# EasyEDA Pro project PY32单片机版电池內阻测试仪.eprj, board PY32版电池內阻测试仪
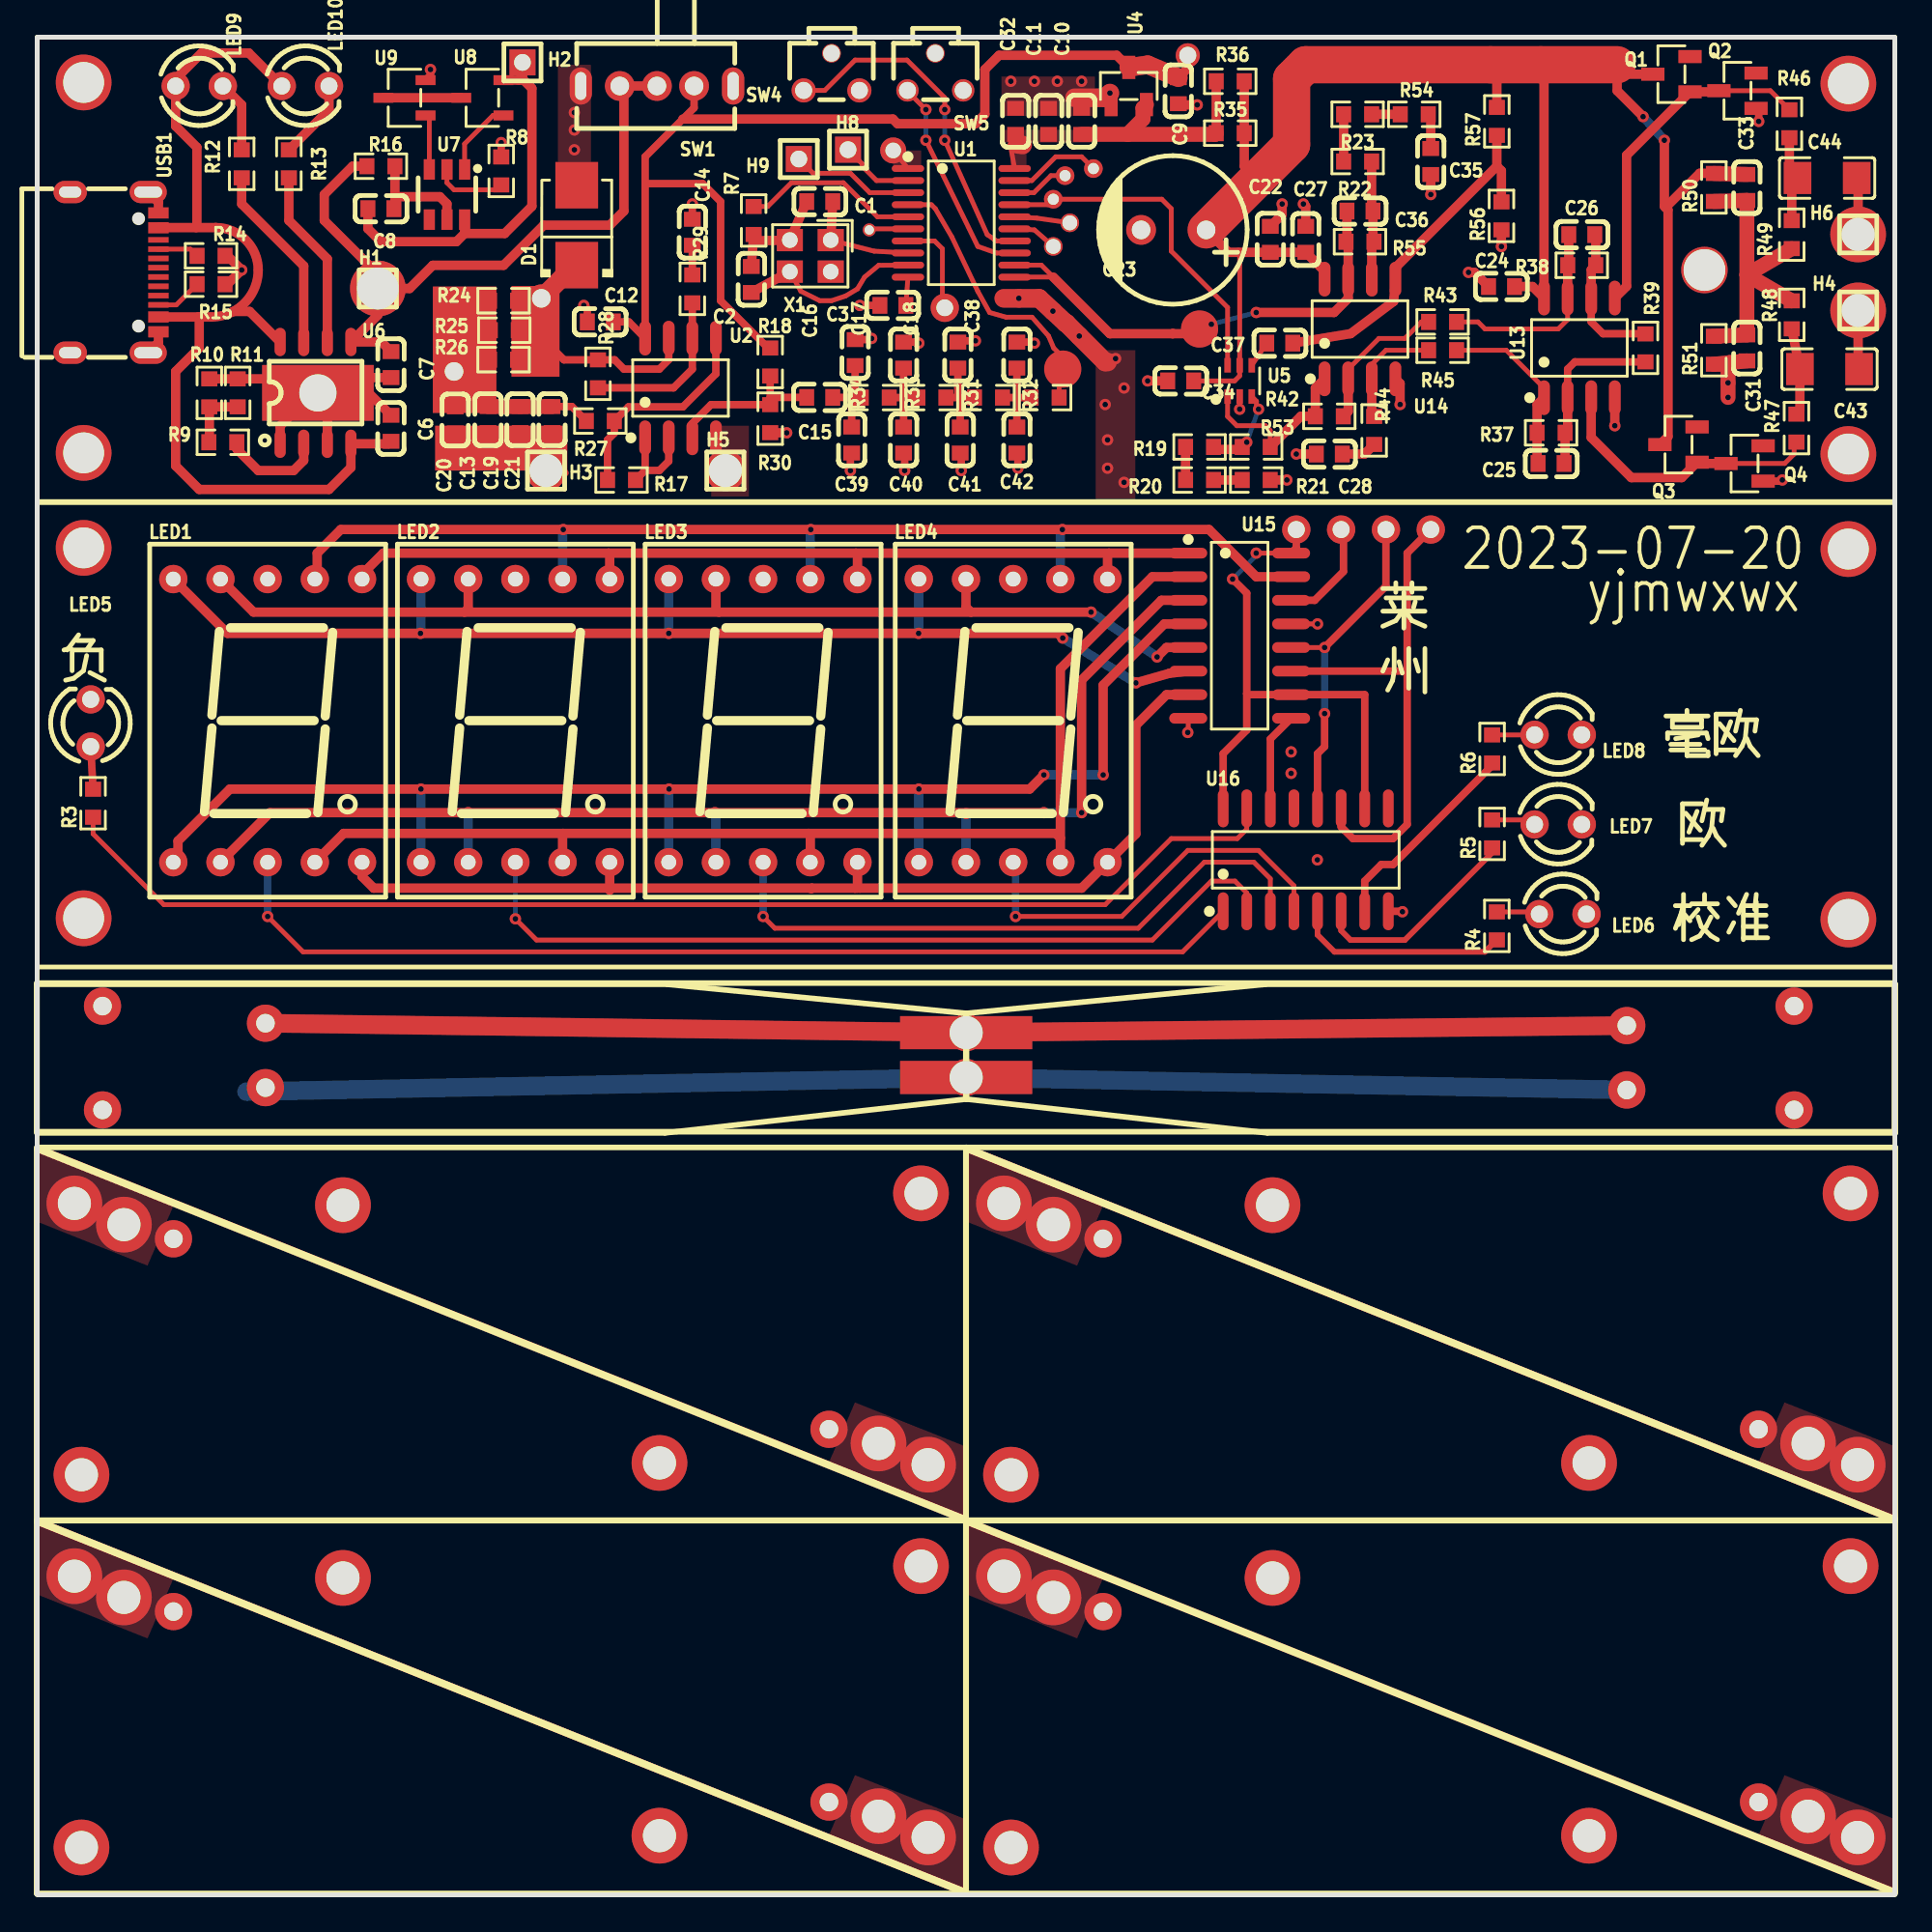
[diagram p1: board, top side]
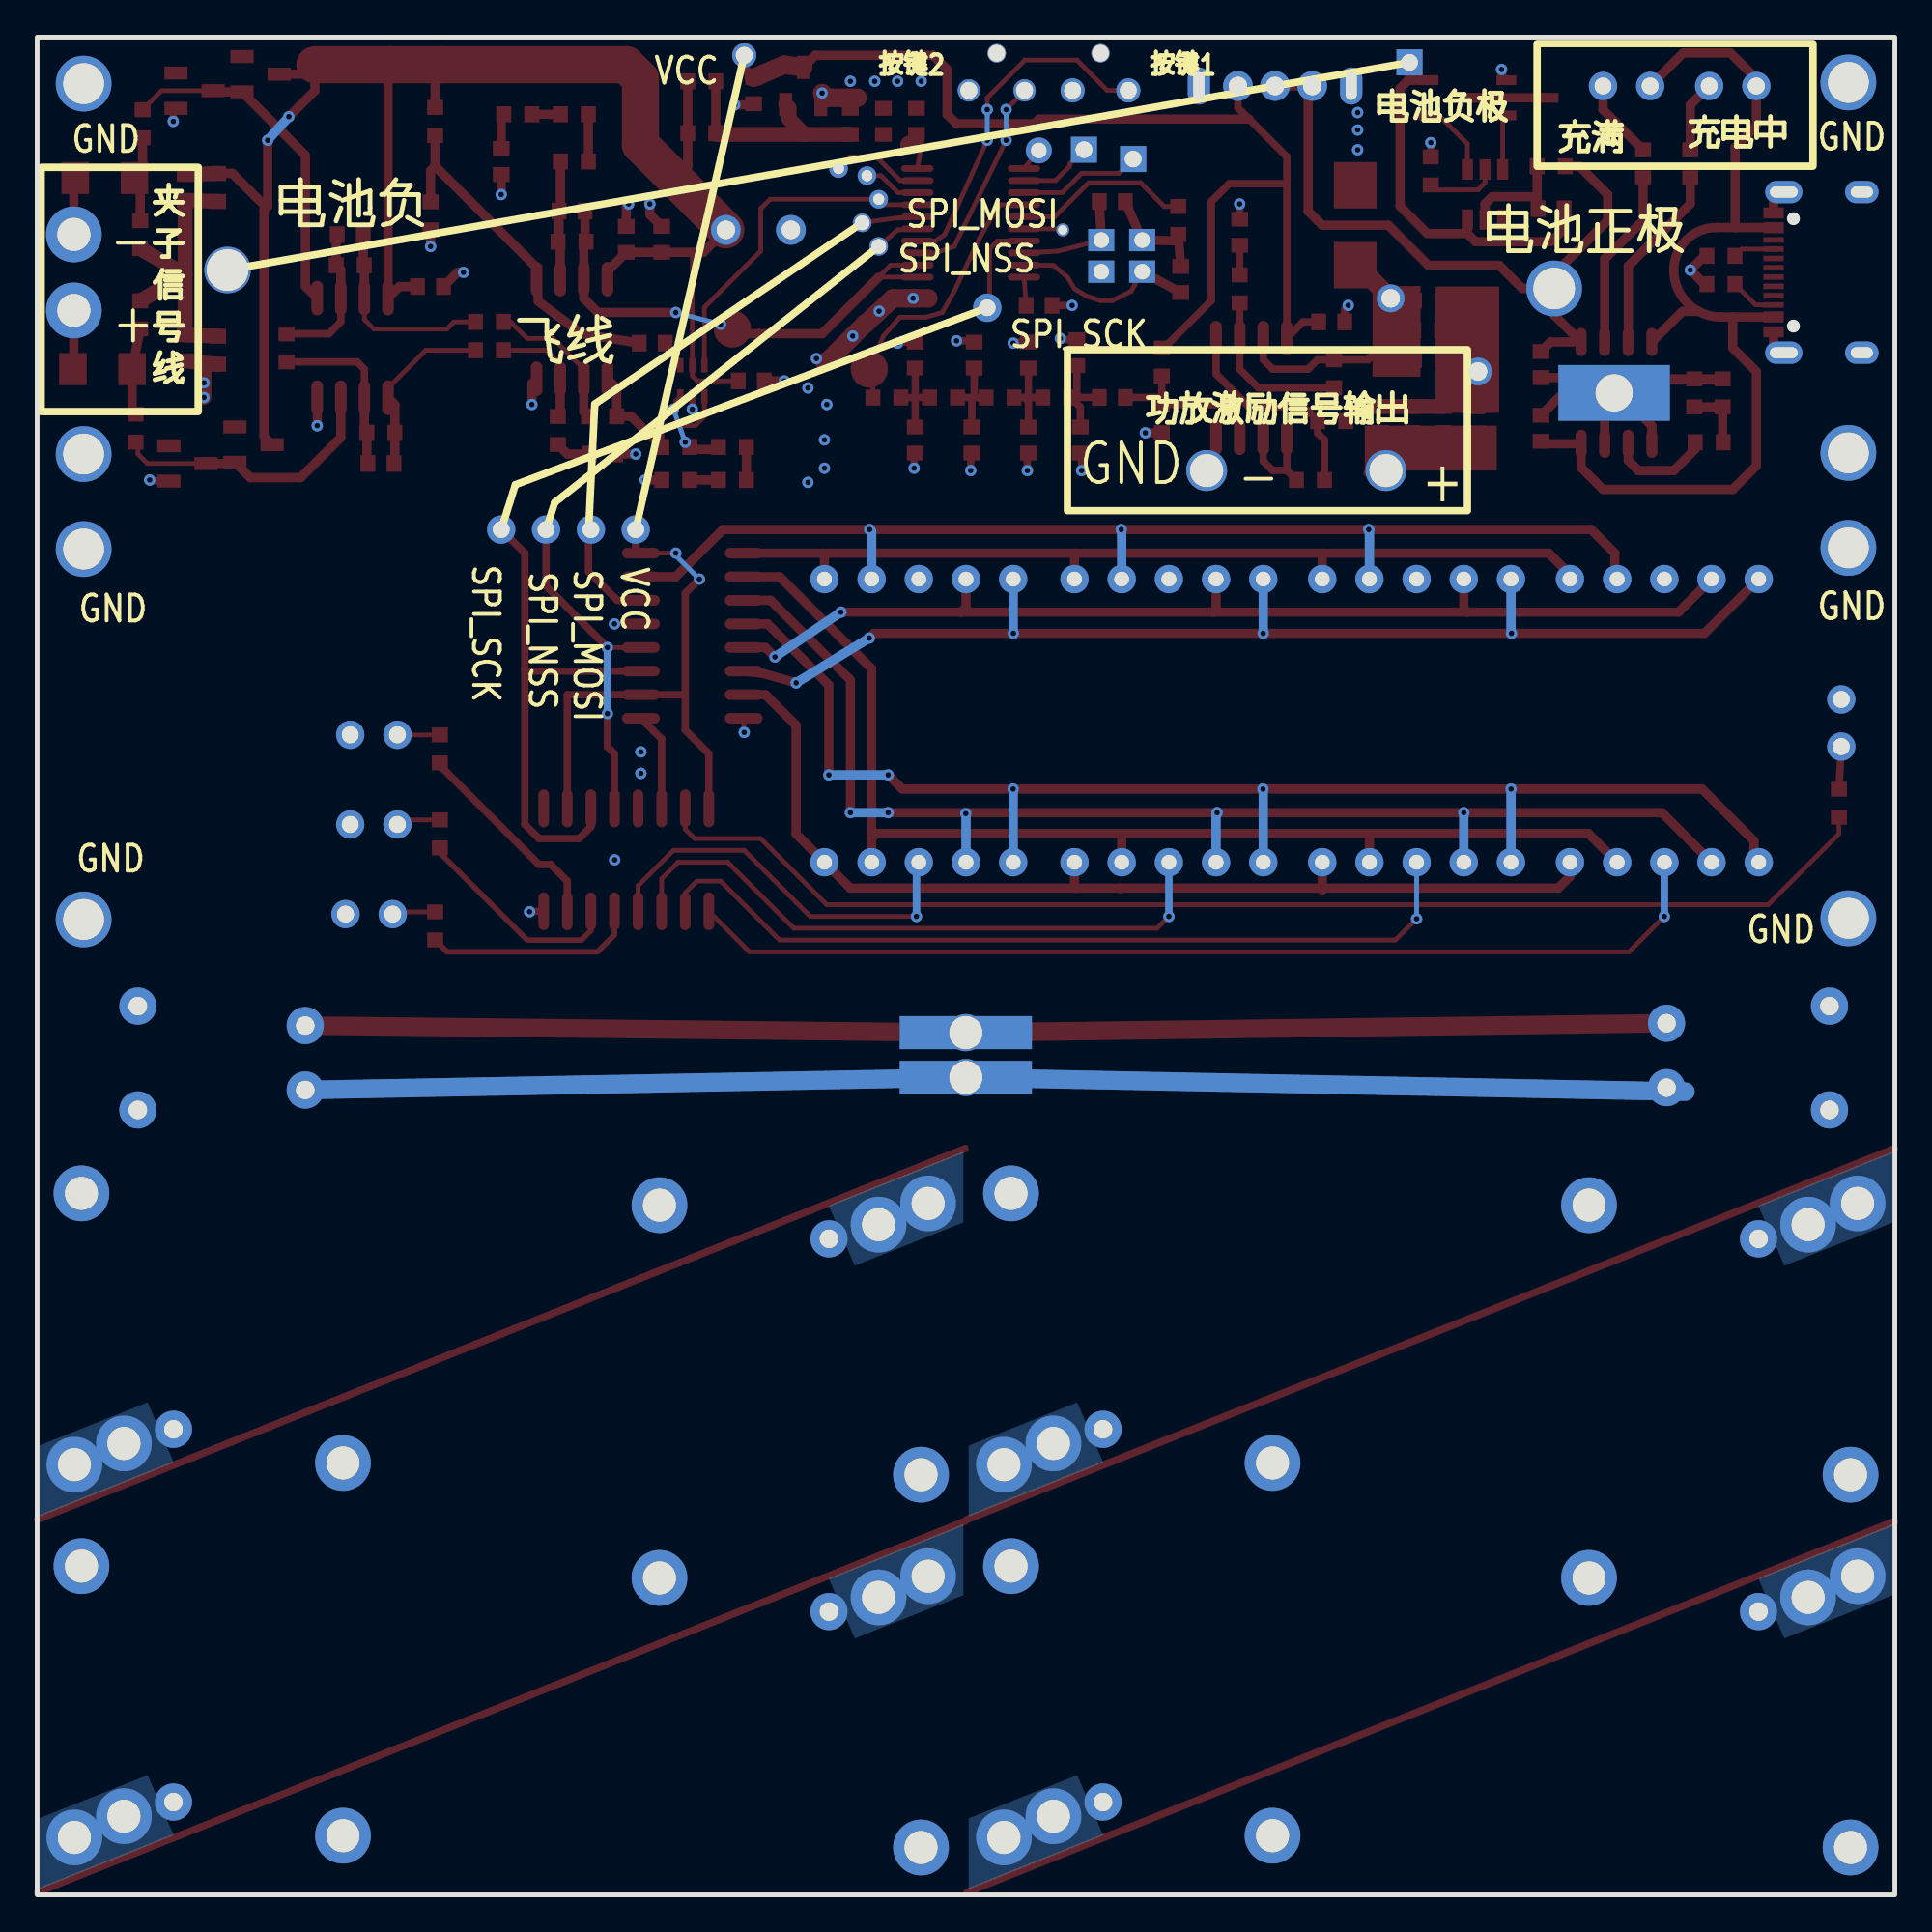
[diagram p2: board, bottom side, seen from below]

Outline 100 x 100 mm; copper layers: Top Layer, Bottom Layer. Coordinates in mm from the lower left corner of the outline.
Outline path: rectangle 0,100 100,0
Stack: Top Layer 0.035mm / Dielectric1 1.51mm FR4 er 4.5 / Bottom Layer 0.035mm

## Design rules (mm)
template: 用户自定义配置
spacing safeClearance (default): track to track 0.152, other pairs 0.152 to 0.3
track width trackWidth (default): min 0.127, default 0.254, max 2.54
differential pair differentialPair (default): width min 0.127, default 0.254, max 2.54; gap min 0.152, default 0.152
via viaSize (default): diameter min 0.5, default 0.61, max 10; hole min 0.3, default 0.305, max 6

## Placement (name value [footprint] x y rotation side)
C1  10pF  [C0603]  42.13 91.15 180 top
C2  10pF  [C0603]  38.44 86.96 270 top
C3  100nF  [C0603]  46.06 85.56 0 top
C6  10uF  [C0603]  19.05 78.95 90 top
C7  10uF  [C0603]  19.05 82.38 90 top
C8  100nF  [C0603]  18.5 90.77 180 top
C9  10uF  [C0603]  61.43 97.12 90 top
C10  100nF  [C0603]  56.22 95.47 270 top
C11  10uF  [C0603]  54.44 95.47 270 top
C12  100nF  [C0603]  30.31 84.67 0 top
C13  10uF  [C0603]  24.27 79.42 90 top
C14  10uF  [C0603]  35.27 89.5 270 top
C15  10uF  [C0603]  42.13 80.61 0 top
C16  1nF  [C0603]  44.03 83.02 270 top
C17  1nF  [C0603]  46.64 82.89 270 top
C18  1nF  [C0603]  49.56 82.89 270 top
C19  10uF  [C0603]  26 79.42 90 top
C20  10uF  [C0603]  22.51 79.4 90 top
C21  10uF  [C0603]  27.72 79.42 90 top
C22  100nF  [C0603]  66.38 89.12 270 top
C23  470uF  [CAP-TH_BD8.0-P3.50-D0.6-FD]  61.18 89.62 180 top
C24  10uF  [C0603]  78.83 86.58 0 top
C25  1nF  [C0603]  81.5 77.05 180 top
C26  1nF  [C0603]  83.15 89.37 180 top
C27  10uF  [C0603]  68.29 89.12 90 top
C28  10uF  [C0603]  69.56 77.56 180 top
C31  10uF  [C0603]  92.04 83.27 90 top
C32  10uF  [C0603]  52.67 95.47 270 top
C33  10uF  [C0603]  92.04 91.91 90 top
C34  10uF  [C0603]  61.56 81.5 180 top
C35  10uF  [C0603]  75.02 93.31 90 top
C36  1nF  [C0603]  71.21 90.64 180 top
C37  100nF  [C0603]  66.89 83.53 180 top
C38  1nF  [C0603]  52.74 82.89 270 top
C39  1nF  [C0603]  43.85 78.31 270 top
C40  1nF  [C0603]  46.64 78.31 270 top
C41  1nF  [C0603]  49.69 78.31 270 top
C42  1nF  [C0603]  52.74 78.31 270 top
C43  100nF  [C1206]  96.48 82.13 180 top
C44  100nF  [C1206]  96.35 92.42 180 top
D1  SMBJ5.0A  [SMB_L4.3-W3.6-LS5.3-RD]  29.04 89.88 90 top
H1  -  [hdr-th_1p-v-m_xkb_x4611wv-01i-c28d40#2]  18.34 86.47 0 top
H2  -  [HDR-TH_1P-V-M_XKB_X4611WV-01I-C28D40]  26.12 98.64 0 top
H3  -  [hdr-th_1p-v-m_xkb_x4611wv-01i-c28d40#3]  27.39 76.67 0 top
H4  -  [hdr-th_1p-v-m_xkb_x4611wv-01i-c28d40]  98.02 85.29 0 top
H5  -  [hdr-th_1p-v-m_xkb_x4611wv-01i-c28d40#3]  37.05 76.67 0 top
H6  -  [hdr-th_1p-v-m_xkb_x4611wv-01i-c28d40]  98.02 89.38 0 top
H8  -  [HDR-TH_1P-V-M_XKB_X4611WV-01I-C28D40]  43.65 93.94 180 top
H9  -  [HDR-TH_1P-V-M_XKB_X4611WV-01I-C28D40]  41 93.44 0 top
LED1  SM420561N  [LED-SEG-TH_10P-L12.7-W19.0-P2.54-S15.24-BL]  12.41 63.21 0 top
LED2  SM420561N  [LED-SEG-TH_10P-L12.7-W19.0-P2.54-S15.24-BL]  25.74 63.21 0 top
LED3  SM420561N  [LED-SEG-TH_10P-L12.7-W19.0-P2.54-S15.24-BL]  39.08 63.21 0 top
LED4  SM420561N  [LED-SEG-TH_10P-L12.7-W19.0-P2.54-S15.24-BL]  52.54 63.21 0 top
LED5  -  [LED_TH-3mm]  2.88 63.08 90 top
LED6  -  [LED_TH-3mm]  82.13 52.79 0 top
LED7  -  [LED_TH-3mm]  81.88 57.62 0 top
LED8  -  [LED_TH-3mm]  81.88 62.45 0 top
LED9  -  [LED_TH-3mm]  8.72 97.37 0 top
LED10  -  [LED_TH-3mm]  14.44 97.37 0 top
NOREF  -  [Pad_e1473]  3.52 47.84 0 top
NOREF#2  -  [Pad_e1215]  4.67 16.01 0 top
NOREF#3  -  [Pad_e1288]  54.71 16.01 0 top
NOREF#4  -  [Pad_e1341]  52.04 37.22 0 top
NOREF#5  -  [Pad_e537]  54.7 91.28 0 top
NOREF#6  -  [Pad_e1147]  47.96 3.09 0 top
NOREF#7  -  [Pad_e34]  44.79 89.62 0 top
NOREF#8  -  [Pad_e1367]  67.78 73.5 0 top
NOREF#9  -  [Pad_e1248]  98 3.09 0 top
NOREF#10  -  [Pad_e1457]  12.29 43.45 0 top
NOREF#11  -  [Pad_e1366]  92.66 25.06 0 top
NOREF#12  -  [Pad_e1474]  3.52 42.25 0 top
NOREF#13  -  [Pad_e242]  15.11 80.85 90 top
NOREF#14  -  [Pad_e98]  97.5 72.44 0 top
NOREF#15  -  [Pad_e1460]  85.57 43.33 0 top
NOREF#16  -  [Pad_e596]  26.83 84.16 0 top
NOREF#17  -  [Pad_e1303]  33.5 23.25 0 top
NOREF#18  -  [Pad_e592]  55.21 82.13 0 top
NOREF#19  -  [Pad_e1451]  50.01 46.41 0 top
NOREF#20  -  [Pad_e1290]  57.38 15.25 0 top
NOREF#21  -  [Pad_e1335]  47.58 37.76 0 top
NOREF#22  -  [Pad_e1337]  52.42 22.62 0 top
NOREF#23  -  [Pad_e536]  54.7 88.73 0 top
NOREF#24  -  [Pad_e508]  22.44 82 0 top
NOREF#25  -  [Pad_e1342]  54.71 36.08 0 top
NOREF#26  -  [Pad_e1475]  94.58 47.84 0 top
NOREF#27  -  [Pad_e15]  2.5 77.62 0 top
NOREF#28  -  [Pad_e1185]  2.38 2.55 0 top
NOREF#29  -  [Pad_e1238]  47.58 17.69 0 top
NOREF#30  -  [Pad_e1350]  97.62 37.76 0 top
NOREF#31  -  [Pad_e571]  27.14 85.94 0 top
NOREF#32  -  [Pad_e1454]  50.01 46.41 0 top
NOREF#33  -  [Pad_e1453]  50.01 44 0 top
NOREF#34  -  [Pad_e1278]  92.66 5 0 top
NOREF#35  -  [Pad_e597]  23.01 83.17 0 top
NOREF#36  -  [Pad_e1368]  83.54 23.25 0 top
NOREF#37  -  [Pad_e1306]  2 37.22 0 top
NOREF#38  -  [Pad_e1179]  16.46 17.06 0 top
NOREF#39  -  [Pad_e1165]  45.29 4.23 0 top
NOREF#40  -  [Pad_e1330]  45.29 24.3 0 top
NOREF#41  -  [Pad_e599]  24.98 77.88 0 top
NOREF#42  -  [Pad_e542]  56.86 92.93 0 top
NOREF#43  -  [Pad_e1363]  70.19 73.5 0 top
NOREF#44  -  [Pad_e1353]  98 23.16 0 top
NOREF#45  -  [Pad_e31]  48.86 85.43 0 top
NOREF#46  -  [Pad_e1336]  66.5 37.13 0 top
NOREF#47  -  [Pad_e1203]  2 17.15 0 top
NOREF#48  -  [Pad_e1343]  57.38 35.31 0 top
NOREF#49  -  [Pad_e1267]  95.33 4.23 0 top
NOREF#50  -  [Pad_e1242]  42.62 5 0 top
NOREF#51  -  [Pad_e1361]  95.33 24.3 0 top
NOREF#52  -  [Pad_e1257]  97.5 77.56 0 top
NOREF#53  -  [Pad_e1455]  50.01 46.41 0 top
NOREF#54  -  [Pad_e1364]  72.61 73.5 0 top
NOREF#55  -  [Pad_e1256]  97.5 97.5 0 top
NOREF#56  -  [Pad_e1459]  85.57 46.79 0 top
NOREF#57  -  [Pad_e1476]  94.58 42.25 0 top
NOREF#58  -  [Pad_e1307]  4.67 36.08 0 top
NOREF#59  -  [Pad_e1458]  12.29 46.92 0 top
NOREF#60  -  [Pad_e1294]  52.42 2.55 0 top
NOREF#61  -  [Pad_e1456]  50.01 44 0 top
NOREF#62  -  [Pad_e538]  55.33 92.55 0 top
NOREF#63  -  [Pad_e1293]  66.5 17.06 0 top
NOREF#64  -  [Pad_e1286]  52.04 17.15 0 top
NOREF#65  -  [Pad_e535]  55.59 90 0 top
NOREF#66  -  [Pad_e1452]  50.01 44 0 top
NOREF#67  -  [Pad_e100]  97.5 52.5 0 top
NOREF#68  -  [Pad_e92]  2.5 52.57 0 top
NOREF#69  -  [Pad_e1246]  97.62 17.69 0 top
NOREF#70  -  [Pad_e1312]  2.38 22.62 0 top
NOREF#71  -  [Pad_e1365]  75.02 73.5 0 top
NOREF#72  -  [Pad_e1324]  47.96 23.16 0 top
NOREF#73  -  [Pad_e1308]  7.34 35.31 0 top
NOREF#74  -  [Pad_e349]  46.08 93.9 180 top
NOREF#75  -  [Pad_e1222]  7.34 15.25 0 top
NOREF#76  -  [Pad_e1157]  62.57 84.29 0 top
NOREF#77  -  [Pad_e609]  89.75 87.47 0 top
NOREF#78  -  [Pad_e1311]  16.46 37.13 0 top
NOREF#79  -  [Pad_e1186]  33.5 3.18 0 top
NOREF#80  -  [Pad_e1279]  83.54 3.18 0 top
NOREF#81  -  [Pad_e1302]  42.62 25.06 0 top
NOREF#82  -  [Pad_e14]  2.5 97.56 0 top
NOREF#83  -  [Pad_e2036]  61.94 99.02 0 top
NOREF#84  -  [Pad_e94]  2.5 72.51 0 top
Q1  SS8050  [SOT-23-3_L2.9-W1.3-P1.90-LS2.4-BR]  87.97 98.01 0 top
Q2  SS8050  [SOT-23-3_L2.9-W1.3-P1.90-LS2.4-BR]  91.53 97.12 0 top
Q3  SS8050  [SOT-23-3_L2.9-W1.3-P1.90-LS2.4-BR]  88.35 78.07 0 top
Q4  SS8050  [SOT-23-3_L2.9-W1.3-P1.90-LS2.4-BR]  91.91 77.05 0 top
R3  1K  [R0603]  3.01 58.76 90 top
R4  1K  [R0603]  78.57 52.16 90 top
R5  1K  [R0603]  78.32 57.11 90 top
R6  1K  [R0603]  78.32 61.68 90 top
R7  10K  [R0603]  38.57 90.13 90 top
R8  1K  [R0603]  24.98 92.8 270 top
R9  1K  [R0603]  10 78.19 0 top
R10  1K  [R0603]  9.27 80.85 270 top
R11  1K  [R0603]  10.79 80.85 270 top
R12  1K  [R0603]  11.01 93.18 90 top
R13  1K  [R0603]  13.55 93.18 90 top
R14  10K  [R0603]  9.36 88.23 180 top
R15  10K  [R0603]  9.36 86.7 180 top
R16  100  [R0603]  18.5 93.05 180 top
R17  10K  [R0603]  31.46 76.16 0 top
R18  1M  [R0603]  39.46 82.51 90 top
R19  100  [R0603]  62.57 77.94 0 top
R20  100  [R0603]  62.57 76.16 180 top
R21  100  [R0603]  65.62 76.16 180 top
R22  100  [R0603]  71.08 93.31 0 top
R23  100  [R0603]  71.08 95.85 180 top
R24  100  [R0603]  25.11 85.81 0 top
R25  100  [R0603]  25.15 84.23 0 top
R26  100  [R0603]  25.11 82.64 0 top
R27  100K  [R0603]  30.31 79.34 0 top
R28  100K  [R0603]  30.19 81.88 270 top
R29  10K  [R0603]  35.27 86.45 270 top
R30  1M  [R0603]  39.46 79.46 90 top
R31  100K  [R0603]  51.21 80.6 180 top
R32  100K  [R0603]  54.26 80.6 180 top
R33  100K  [R0603]  48.16 80.6 180 top
R34  100K  [R0603]  45.12 80.6 180 top
R35  10Ω  [R0603]  64.22 94.83 180 top
R36  10Ω  [R0603]  64.22 97.62 180 top
R37  10K  [R0603]  81.5 78.7 180 top
R38  10K  [R0603]  83.15 87.72 180 top
R39  1K  [R0603]  86.58 83.27 270 top
R42  10K  [R0603]  69.56 79.59 180 top
R43  10K  [R0603]  75.65 84.67 180 top
R44  10K  [R0603]  71.97 78.83 270 top
R45  10K  [R0603]  75.65 83.15 180 top
R46  1K  [R0603]  94.32 95.34 90 top
R47  1K  [R0603]  94.7 78.96 270 top
R48  1M  [R0603]  94.45 85.05 270 top
R49  1M  [R0603]  94.45 89.37 270 top
R50  1K  [R0603]  90.26 91.91 90 top
R51  1K  [R0603]  90.26 83.15 90 top
R53  10K  [R0603]  65.62 77.94 0 top
R54  100  [R0603]  74.13 95.85 180 top
R55  10K  [R0603]  71.21 88.99 180 top
R56  1M  [R0603]  78.82 90.38 90 top
R57  1M  [R0603]  78.57 95.47 90 top
SW1  SK-12D02-G060  [SW-TH_SK-12D02-G060]  33.36 97.37 180 top
SW4  HX TS4538B3J 250gf  [sw-th_ts4538b3j#2]  42.76 98.13 180 top
SW5  HX TS4538B3J 250gf  [sw-th_ts4538b3j]  48.35 98.13 180 top
U1  PY32F002AF15P6TU  [TSSOP-20_L6.5-W4.4-P0.65-LS6.4-BL]  49.75 90 270 top
U2  LMV358ARZ  [SOP-8_L4.9-W3.9-P1.27-LS6.0-BL]  34.63 81.11 0 top
U4  662K.  [SOT-23-3_L2.9-W1.3-P1.90-LS2.4-BR]  58.76 97.37 270 top
U5  SGM3157  [SC-70-6_L2.2-W1.3-P0.65-LS2.1-BL]  64.73 81.5 0 top
U6  WSP4056  [SOP-8_L5.1-W3.9-P1.27-LS6.0-BL]  14.98 80.85 0 top
U7  WSTDW01  [SOT-23-6_L2.9-W1.6-P0.95-LS2.8-BR]  22.06 91.53 90 top
U8  AO3400A  [SOT-23-3_L3.0-W1.6-P1.90-LS2.8-BR]  23.97 96.74 0 top
U9  AO3400A  [SOT-23-3_L3.0-W1.6-P1.90-LS2.8-BR]  19.77 96.74 0 top
U13  LMV358ARZ  [SOP-8_L4.9-W3.9-P1.27-LS6.0-BL]  83.02 83.27 0 top
U14  LMV358ARZ  [SOP-8_L4.9-W3.9-P1.27-LS6.0-BL]  71.21 84.29 0 top
U15  74HC595D.  [SOP-16_L9.9-W3.9-P1.27-LS6.0-BL]  64.73 67.78 270 top
U16  74HC595D.  [SOP-16_L9.9-W3.9-P1.27-LS6.0-BL]  68.29 55.72 0 top
USB1  TYPE-C 16PIN 2MD(073)  [USB-C-SMD_TYPE-C-6PIN-2MD-073]  4.15 87.34 270 top
X1  24MHz  [crystal-smd_4p-l3.2-w2.5-bl]  41.62 88.23 180 top

## Footprints (pads in the part's own frame, mm; a bottom-side part is the same pattern mirrored in y, then rotated)
C0603
  rect 0.8x0.9 smd: 1(-0.7,0) 2(0.7,0)
C1206
  rect 1.485x1.728 smd: 1(-1.593,0) 2(1.593,0)
CAP-TH_BD8.0-P3.50-D0.6-FD
  round 1.6 hole 1: 1(-1.75,0) 2(1.75,0)
crystal-smd_4p-l3.2-w2.5-bl
  rect 1.4x1.2 hole 0.84: 1(-1.1,-0.85) 2(1.1,-0.85) 3(1.1,0.85) 4(-1.1,0.85)
hdr-th_1p-v-m_xkb_x4611wv-01i-c28d40
  round 3 hole 1.78: 1(0,0)
hdr-th_1p-v-m_xkb_x4611wv-01i-c28d40#2
  round 3 hole 2.24: 1(0,0)
hdr-th_1p-v-m_xkb_x4611wv-01i-c28d40#3
  round 2.2 hole 1.78: 1(0,0)
HDR-TH_1P-V-M_XKB_X4611WV-01I-C28D40
  rect 1.4x1.4 hole 0.9: 1(0,0)
LED-SEG-TH_10P-L12.7-W19.0-P2.54-S15.24-BL
  round 1.524 hole 0.8: 1(-5.08,-7.62) 2(-2.54,-7.62) 3(0,-7.62) 4(2.54,-7.62) 5(5.08,-7.62) 6(5.08,7.62) 7(2.54,7.62) 8(0,7.62) 9(-2.54,7.62) 10(-5.08,7.62)
LED_TH-3mm
  round 1.524 hole 0.914: 1(-1.27,0) 2(1.27,0)
Pad_e14
  round 3 hole 2.2: 1(0,0)
Pad_e15
  round 3 hole 2.2: 1(0,0)
Pad_e31
  round 1.524 hole 0.9: 1(0,0)
Pad_e34
  round 0.7 hole 0.5: 2(0,0)
Pad_e92
  round 3 hole 2.2: 1(0,0)
Pad_e94
  round 3 hole 2.2: 1(0,0)
Pad_e98
  round 3 hole 2.2: 1(0,0)
Pad_e100
  round 3 hole 2.2: 1(0,0)
Pad_e242
  rect 3x6 hole 2: 1(0,0)
Pad_e349
  round 1.4 hole 0.84: 1(0,0)
Pad_e508
  round 1.5 hole 1: 1(0,0)
Pad_e535
  round 1 hole 0.8: 1(0,0)
Pad_e536
  round 1 hole 0.8: 1(0,0)
Pad_e537
  round 1 hole 0.6: 1(0,0)
Pad_e538
  round 1 hole 0.6: 1(0,0)
Pad_e542
  round 1 hole 0.6: 1(0,0)
Pad_e571
  round 1.5 hole 1: 2(0,0)
Pad_e592
  round 2 smd: TP1(0,0)
Pad_e596
  rect 2.584x4.879 smd: 3(0,0)
Pad_e597
  rect 3.421x6.805 smd: 4(0,0)
Pad_e599
  rect 7.112x2.413 smd: 5(0,0)
Pad_e609
  round 2.5 hole 2.24: 3(0,0)
Pad_e1147
  round 3 hole 1.78: 1(0,0)
Pad_e1157
  round 2 smd: TP3(0,0)
Pad_e1165
  round 3 hole 1.78: 1(0,0)
Pad_e1179
  round 3 hole 1.78: 1(0,0)
Pad_e1185
  round 3 hole 1.78: 1(0,0)
Pad_e1186
  round 3 hole 1.78: 1(0,0)
Pad_e1203
  round 3 hole 1.78: 1(0,0)
Pad_e1215
  round 3 hole 1.78: 1(0,0)
Pad_e1222
  round 2 hole 1: 2(0,0)
Pad_e1238
  round 3 hole 1.78: 1(0,0)
Pad_e1242
  round 2 hole 1: 2(0,0)
Pad_e1246
  round 3 hole 1.78: 1(0,0)
Pad_e1248
  round 3 hole 1.78: 1(0,0)
Pad_e1256
  round 3 hole 2.2: 1(0,0)
Pad_e1257
  round 3 hole 2.2: 1(0,0)
Pad_e1267
  round 3 hole 1.78: 1(0,0)
Pad_e1278
  round 2 hole 1: 2(0,0)
Pad_e1279
  round 3 hole 1.78: 1(0,0)
Pad_e1286
  round 3 hole 1.78: 1(0,0)
Pad_e1288
  round 3 hole 1.78: 1(0,0)
Pad_e1290
  round 2 hole 1: 2(0,0)
Pad_e1293
  round 3 hole 1.78: 1(0,0)
Pad_e1294
  round 3 hole 1.78: 1(0,0)
Pad_e1302
  round 2 hole 1: 2(0,0)
Pad_e1303
  round 3 hole 1.78: 1(0,0)
Pad_e1306
  round 3 hole 1.78: 1(0,0)
Pad_e1307
  round 3 hole 1.78: 1(0,0)
Pad_e1308
  round 2 hole 1: 2(0,0)
Pad_e1311
  round 3 hole 1.78: 1(0,0)
Pad_e1312
  round 3 hole 1.78: 1(0,0)
Pad_e1324
  round 3 hole 1.78: 1(0,0)
Pad_e1330
  round 3 hole 1.78: 1(0,0)
Pad_e1335
  round 3 hole 1.78: 1(0,0)
Pad_e1336
  round 3 hole 1.78: 1(0,0)
Pad_e1337
  round 3 hole 1.78: 1(0,0)
Pad_e1341
  round 3 hole 1.78: 1(0,0)
Pad_e1342
  round 3 hole 1.78: 1(0,0)
Pad_e1343
  round 2 hole 1: 2(0,0)
Pad_e1350
  round 3 hole 1.78: 1(0,0)
Pad_e1353
  round 3 hole 1.78: 1(0,0)
Pad_e1361
  round 3 hole 1.78: 1(0,0)
Pad_e1363
  round 1.524 hole 0.914: 1(0,0)
Pad_e1364
  round 1.524 hole 0.914: 2(0,0)
Pad_e1365
  round 1.524 hole 0.914: 3(0,0)
Pad_e1366
  round 2 hole 1: 2(0,0)
Pad_e1367
  round 1.524 hole 0.914: 4(0,0)
Pad_e1368
  round 3 hole 1.78: 1(0,0)
Pad_e1451
  round 2 hole 1.78: 2(0,0)
Pad_e1452
  round 2 hole 1.78: 1(0,0)
Pad_e1453
  rect 7.112x1.778 smd: 4(0,0)
Pad_e1454
  rect 7.112x1.778 smd: 3(0,0)
Pad_e1455
  rect 7.112x1.778 smd far side: 5(0,0)
Pad_e1456
  rect 7.112x1.778 smd far side: 6(0,0)
Pad_e1457
  round 2 hole 1: 3(0,0)
Pad_e1458
  round 2 hole 1: 3(0,0)
Pad_e1459
  round 2 hole 1: 3(0,0)
Pad_e1460
  round 2 hole 1: 3(0,0)
Pad_e1473
  round 2 hole 1: 3(0,0)
Pad_e1474
  round 2 hole 1: 3(0,0)
Pad_e1475
  round 2 hole 1: 3(0,0)
Pad_e1476
  round 2 hole 1: 3(0,0)
Pad_e2036
  round 1.3 hole 0.914: 4(0,0)
R0603
  rect 0.806x0.864 smd: 1(-0.753,0) 2(0.753,0)
SC-70-6_L2.2-W1.3-P0.65-LS2.1-BL
  rect 0.35x0.78 smd: 1(-0.65,-0.84) 2(0,-0.84) 3(0.65,-0.84) 4(0.65,0.84) 5(0,0.84) 6(-0.65,0.84)
SMB_L4.3-W3.6-LS5.3-RD
  rect 2.5x2.3 smd: 1(-2.15,0) 2(2.15,0)
SOP-8_L4.9-W3.9-P1.27-LS6.0-BL
  oval 0.63x1.865 smd: 1(-1.905,-2.683) 2(-0.635,-2.683) 3(0.635,-2.683) 4(1.905,-2.683) 5(1.905,2.683) 6(0.635,2.683) 7(-0.635,2.683) 8(-1.905,2.683)
SOP-8_L5.1-W3.9-P1.27-LS6.0-BL
  oval 0.6x1.52 smd: 1(-1.905,-2.74) 2(-0.635,-2.74) 3(0.635,-2.74) 4(1.905,-2.74) 5(1.905,2.74) 6(0.635,2.74) 7(-0.635,2.74) 8(-1.905,2.74)
SOP-16_L9.9-W3.9-P1.27-LS6.0-BL
  oval 0.574x2.038 smd: 1(-4.445,-2.769) 2(-3.175,-2.769) 3(-1.905,-2.769) 4(-0.635,-2.769) 5(0.635,-2.769) 6(1.905,-2.769) 7(3.175,-2.769) 8(4.445,-2.769) 9(4.445,2.769) 10(3.175,2.769) 11(1.905,2.769) 12(0.635,2.769) 13(-0.635,2.769) 14(-1.905,2.769) 15(-3.175,2.769) 16(-4.445,2.769)
SOT-23-3_L2.9-W1.3-P1.90-LS2.4-BR
  rect 1.25x0.7 smd: 1(1,-0.95) 2(1,0.95) 3(-1,0)
SOT-23-3_L3.0-W1.6-P1.90-LS2.8-BR
  rect 1.07x0.532 smd: 1(1.135,-0.95) 2(1.135,0.95) 3(-1.135,0)
SOT-23-6_L2.9-W1.6-P0.95-LS2.8-BR
  rect 1.1x0.6 smd: 1(1.35,-0.95) 2(1.35,0) 3(1.35,0.95) 4(-1.35,0.95) 5(-1.35,0) 6(-1.35,-0.95)
SW-TH_SK-12D02-G060
  round 1.6 hole 1: 1(-2,0) 2(0,0) 3(2,0)
  oval 1.2x2 hole 0.6x1.5: 4(-4.1,0) 5(4.1,0)
sw-th_ts4538b3j
  round 1.2 hole 0.914: 1(-1.5,1) 2(1.5,1)
  round 1 hole 0.9: 3(0,-1)
sw-th_ts4538b3j#2
  round 1.3 hole 0.914: 1(-1.5,1) 2(1.5,1)
  round 1 hole 0.9: 3(0,-1)
TSSOP-20_L6.5-W4.4-P0.65-LS6.4-BL
  oval 0.364x1.742 smd: 1(-2.925,-2.871) 2(-2.275,-2.871) 3(-1.625,-2.871) 4(-0.975,-2.871) 5(-0.325,-2.871) 6(0.325,-2.871) 7(0.975,-2.871) 8(1.625,-2.871) 9(2.275,-2.871) 10(2.925,-2.871) 11(2.925,2.871) 12(2.275,2.871) 13(1.625,2.871) 14(0.975,2.871) 15(0.325,2.871) 16(-0.325,2.871) 17(-0.975,2.871) 18(-1.625,2.871) 19(-2.275,2.871) 20(-2.925,2.871)
USB-C-SMD_TYPE-C-6PIN-2MD-073
  rect 0.6x1.1 smd: 1(-3.2,2.375) 2(-2.4,2.375) 11(2.4,2.375) 12(3.2,2.375)
  rect 0.3x1.1 smd: 3(-1.75,2.375) 4(-1.25,2.375) 5(-0.75,2.375) 6(-0.25,2.375) 7(0.25,2.375) 8(0.75,2.375) 9(1.25,2.375) 10(1.75,2.375)
  oval 1.2x2 hole 0.6x1.5: 13(-4.325,1.825) 14(4.325,1.825)
  oval 1.2x1.8 hole 0.6x1.2: 13(-4.325,-2.375) 14(4.325,-2.375)

## Nets
+1.65V: C31.2 C33.1 R48.1 R49.2 R50.1 R51.2
+3.3V: C10.2 C11.2 C32.2 R35.2 R36.2 U1.20 U4.2
+3.3VA: C22.2 C23.1 C24.2 C27.1 C33.2 C34.1 Q1.3 Q3.3 R35.1 R36.1 R50.2 R57.2 U5.5 U13.8 U14.8
GND: C1.2 C2.1 C3.1 C6.2 C7.1 C9.1 C10.1 C11.1 C12.1 C14.1 C16.1 C17.1 C18.1 C22.1 C23.2 C24.1 C27.2 C28.2 C31.1 C32.1 C34.2 C35.1 C38.1 C39.2 C40.2 C41.2 C42.2 D1.2 H5.1 LED5.2 LED6.2 LED7.2 LED8.2 NOREF.3 NOREF#12.3 NOREF#13.1 NOREF#14.1 NOREF#17.1 NOREF#21.1 NOREF#22.1 NOREF#26.3 NOREF#27.1 NOREF#28.1 NOREF#29.1 NOREF#30.1 NOREF#36.1 NOREF#38.1 NOREF#46.1 NOREF#52.1 NOREF#55.1 NOREF#57.3 NOREF#60.1 NOREF#63.1 NOREF#67.1 NOREF#68.1 NOREF#69.1 NOREF#70.1 NOREF#74.1 NOREF#78.1 NOREF#79.1 NOREF#80.1 NOREF#82.1 NOREF#84.1 Q2.1 Q4.1 R7.1 R8.1 R10.1 R11.1 R14.1 R15.1 R21.1 R30.1 R51.1 R56.1 SW1.4 SW1.5 SW4.1 SW4.3 SW5.1 SW5.3 U1.1 U2.4 U4.1 U5.2 U6.1 U6.3 U9.2 U13.4 U14.4 U15.8 U15.13 U16.8 U16.13 USB1.1 USB1.12 USB1.13 USB1.14 X1.2 X1.4
VCC: C9.2 C12.2 NOREF#8.4 NOREF#83.4 R18.2 SW1.1 U2.8 U4.3 U15.10 U15.16 U16.10 U16.16
BT+: C7.2 H1.1 R16.2 SW1.2 SW1.3 U6.5
BT-: C8.2 H2.1 NOREF#77.3 U7.6 U8.2
PA0_ADC: C36.2 NOREF#76.TP3 R55.2 U1.11 U1.12 U14.7
PA4_NSS: NOREF#23.1 NOREF#54.2 U1.15 U15.12 U16.12
PA5_SCK: NOREF#45.1 NOREF#71.3 U1.7 U15.11 U16.11
PA7_MOSI: NOREF#43.1 NOREF#65.1 U1.16 U15.14
PB0_FANG_DA: NOREF#5.1 U1.17 U5.6
PB3_TIM1_CH2_PWM: NOREF#18.TP1 R32.1 U1.4
$1N3675: LED1.10 LED2.10 LED3.10 LED4.10 U15.6
$1N3680: LED1.9 LED2.9 LED3.9 LED4.9 U15.5
$1N5737: LED1.3 U16.1
$1N5765: LED2.3 U16.2
$1N5793: LED3.3 U16.3
$1N5821: LED4.3 U16.4
$1N6685: LED6.1 R4.2
$1N6896: LED7.1 R5.2
$1N6922: LED8.1 R6.2
$1N7000: R4.1 U16.5
$1N7028: R5.1 U16.6
$1N7057: R6.1 U16.7
$1N8069: U15.9 U16.14
$1N8265: LED5.1 R3.2
$1N8293: R3.1 U16.15
$1N8810: LED1.1 LED2.1 LED3.1 LED4.1 U15.4
$1N8839: LED1.2 LED2.2 LED3.2 LED4.2 U15.3
$1N8868: LED1.4 LED2.4 LED3.4 LED4.4 U15.2
$1N8897: LED1.5 LED2.5 LED3.5 LED4.5 U15.7
$1N9196: LED1.6 LED2.6 LED3.6 LED4.6 U15.1
$1N9408: LED1.7 LED2.7 LED3.7 LED4.7 U15.15
$1N11543: C1.1 U1.8 X1.1
$1N11575: C2.2 U1.9 X1.3
$1N11831: C3.2 U1.10
$1N12390: R7.2 U1.5
$1N13187: H8.1 U1.2
$1N13230: H9.1 U1.3
$1N13991: U8.3 U9.3
$1N14154: U7.1 U8.1
$1N14198: U7.3 U9.1
$1N14351: R8.2 U7.2
$1N14884: R9.1 R10.2 R11.2
$1N15015: R9.2 U6.2
$1N15682: LED9.2 R12.2
$1N15797: LED10.2 R13.2
$1N15845: R12.1 U6.7
$1N15894: R13.1 U6.6
$1N16826: R14.2 USB1.4
$1N16875: R15.2 USB1.10
$1N17421: C6.1 LED9.1 LED10.1 U6.4 U6.8 USB1.2 USB1.11
$1N19532: C8.1 R16.1 U7.5
$1N29722: C13.2 C19.2 C20.2 C21.2 NOREF#24.1 NOREF#35.4 R24.1 R25.1 R26.1 R27.1
$1N30545: R28.2 R29.2 U2.6
$1N31466: R17.1 R27.2 U2.5
$1N35483: D1.1 NOREF#16.3 NOREF#31.2 R24.2 R25.2 R26.2 R28.1 U2.7
$1N36571: R17.2 U2.1 U2.2
$1N41452: C17.2 C40.1 R33.2 R34.1
$1N41532: C15.2 C16.2 C39.1 R34.2
$1N41612: C15.1 R18.1 R30.2 U2.3
$1N44249: C13.1 C19.1 C20.1 C21.1 H3.1 NOREF#41.5
$1N45108: C14.2 R29.1
$1N80691: C25.1 R37.1 R39.2 U13.2
$1N81427: C26.1 R38.1 R39.1 U13.6
$1N81532: C26.2 R38.2 R43.1 U13.7
$1N83998: C28.1 R44.2
$1N85039: R42.1 R43.2 U14.2
$1N86076: R44.1 R45.2 U14.3
$1N86077: C25.2 R37.2 R45.1 U13.1
$1N94982: Q3.1 Q4.3 R47.2 U13.3
$1N95485: Q1.1 Q2.3 R46.2 U13.5
$1N97809: R19.1 R20.2
$1N97810: R20.1 R21.2
$1N99087: R19.2 R53.1 U5.3
$1N104717: R42.2 R53.2 U5.1 U14.1
$1N108179: R22.1 R23.2
$1N108180: R23.1 R54.2
$1N108784: C35.2 R54.1
$1N111292: C37.2 U5.4
$1N135539: C38.2 C42.1 R31.1 R32.2
$1N135540: C18.2 C41.1 R31.2 R33.1
$1N150179: C37.1 R56.2 R57.1 U14.5
$1N150210: C36.1 R22.2 R55.1 U14.6
$1N150464: C43.1 H4.1
$1N150468: C43.2 R47.1 R48.2
$1N150580: C44.2 R46.1 R49.1
$1N150583: C44.1 H6.1
$1N158319: SW5.2 U1.13
$1N158326: SW4.2 U1.14

Pads without a net: LED1 8; LED2 8; LED3 8; LED4 8; NOREF#2 1; NOREF#3 1; NOREF#4 1; NOREF#6 1; NOREF#7 2; NOREF#9 1; NOREF#10 3; NOREF#11 2; NOREF#15 3; NOREF#19 2; NOREF#20 2; NOREF#25 1; NOREF#32 3; NOREF#33 4; NOREF#34 2; NOREF#37 1; NOREF#39 1; NOREF#40 1; NOREF#42 1; NOREF#44 1; NOREF#47 1; NOREF#48 2; NOREF#49 1; NOREF#50 2; NOREF#51 1; NOREF#53 5; NOREF#56 3; NOREF#58 1; NOREF#59 3; NOREF#61 6; NOREF#62 1; NOREF#64 1; NOREF#66 1; NOREF#72 1; NOREF#73 2; NOREF#75 2; NOREF#81 2; Q1 2; Q2 2; Q3 2; Q4 2; U1 6 18 19; U7 4; U16 9; USB1 3 5 6 7 8 9

## Via types
v1: diameter 0.61, hole 0.305, Top Layer to Bottom Layer, 93 vias

## Routing (per net, layer and track width the routed paths; a pad name or vN(x,y) marks a point on that pad's centre or on a via; arc(x,y) is an arc through that point)
+1.65V: length 16.4
  Top Layer w0.8: R49.2 92.04,87.21 ; 92.04,87.21 R48.1 ; 92.04,87.21 C33.1 R50.1 ; 92.04,87.21 C31.2 R51.2
+3.3V: length 14.2
  Top Layer w0.254: 52.62,92.93 52.38,94.23 ; 52.76,94.23 C32.2
  Top Layer w0.5: R36.2 R35.2
  Top Layer w0.8: 58.7,94.77 63.41,94.77 R35.2 ; 58.7,94.77 C10.2 ; 58.7,94.77 59.53,95.59 59.53,96.18 U4.2
  Top Layer w1: 52.76,94.23 53.05,94.2
+3.3VA: length 96.1
  Top Layer w0.254: 64.66,88.42 64.73,88.35 U5.5 64.73,81.77 64.46,81.5 C34.1
  Top Layer w0.5: 65.67,92.36 64.98,93.06 R35.1 R36.1 ; 80.96,98.51 81.12,98.36 U13.8 80.5,86.58 C24.2 ; 85.05,98.07 85.05,98.51 ; 85.05,98.07 85.12,98.01 Q1.3 ; 85.05,98.07 85.05,97.12 v1(86.45,95.72) ; 78.25,98.51 78.57,98.19 R57.2 ; 87.65,90.83 89.5,92.67 90.25,92.67 R50.2 ; 87.65,90.83 87.79,90.69 87.79,78.5 Q3.3 ; 87.65,90.83 87.59,90.89 v1(87.59,94.45) ; C23.1 64.13,88.42 C22.2 C27.1 69.3,87.4 U14.8
  Top Layer w0.8: R50.2 C33.2
  Top Layer w2: C23.1 65.67,92.36 67.53,94.22 67.53,97.75 68.29,98.51 85.05,98.51
  Bottom Layer w0.5: v1(87.59,94.45) v1(86.45,95.72)
GND: length 78.5
  Top Layer w0.254: v1(61.94,62.57) 61.96,62.6 U15.8 ; v1(64.73,79.97) U5.2 ; U1.1 NOREF#74.1 ; U15.13 v1(68.92,68.42)
  Top Layer w0.4: v1(73.5,52.92) 73.47,52.95 U16.8 ; 43.85,77.61 43.78,77.54 v1(43.78,76.67) ; C17.1 47.4,83.59 v1(47.46,83.53) ; v1(24.98,94.32) R8.1 ; C16.1 44.86,83.72 v1(44.92,83.78) ; C38.1 53.63,83.59 v1(53.68,83.53) ; v1(21.17,98.26) 21.17,97.95 U9.2 ; 49.69,77.61 49.75,77.56 v1(49.75,76.67) ; v1(52.79,76.8) 52.79,77.56 52.74,77.61 ; v1(35.27,91.02) C14.1 ; v1(46.7,76.67) 46.7,77.56 46.64,77.61 ; C12.1 29.62,85.37 v1(29.43,85.56) ; v1(50.51,83.66) 49.63,83.66 C18.1 ; v1(93.94,76.16) 93.88,76.1 Q4.1 ; v1(92.67,95.47) 92.67,96.02 92.53,96.17 ; v1(44.28,85.56) C3.1
  Top Layer w0.5: v1(62.45,96.35) 61.49,96.35 C9.1 ; R15.1 10.25,86.7 v1(11.01,87.47) 10.25,88.23 R14.1 ; v1(77.05,87.34) 77.37,87.34 78.13,86.58 ; NOREF#13.1 14.36,81.6 R11.1 R10.1 ; NOREF#13.1 17.84,80.85 C6.2 ; NOREF#13.1 15.62,80.34 U6.3 ; NOREF#13.1 15.94,81.67 C7.1 ; NOREF#13.1 14.86,80.85 13.08,79.07 U6.1 ; 57.81,96.37 57.75,96.44 v1(57.75,96.99) ; v1(78.82,88.73) R56.1 ; R30.1 39.47,78.7 v1(40.35,78.7) ; v1(68.16,91.02) 68.29,90.89 C27.2 ; USB1.12 6.53,83.56 USB1.14 ; v1(67.78,77.56) C28.2 ; v1(75.02,91.53) C35.1 ; C22.1 67.02,90.45 v1(67.02,91.02) ; C1.2 X1.2 38.54,89.04 ; USB1.13 6.53,91.11 USB1.1 ; 38.54,89.04 R7.1 ; 38.54,89.04 C2.1 ; C34.2 v1(59.78,81.5) ; v1(73.37,80.23) 73.37,81.35 U14.4 ; v1(84.93,79.08) U13.4 ; v1(67.27,76.16) R21.1
  Top Layer w0.8: v1(91.02,80.61) v1(91.02,81.39) 91.02,82.4 91.1,82.48 ; 91.1,82.48 R51.1 ; 91.1,82.48 C31.1
  Top Layer w1: 52.03,85.94 v1(52.85,85.94) 53.94,85.94 v1(54.68,85.25) 55.38,84.6 55.4,84.6 v1(56.1,83.91) 57.49,82.51 57.62,82.51 ; 55.84,96.74 57.49,96.74 v1(57.75,96.99)
  vias: v1(28.92,95.94) v1(28.92,95) v1(28.92,93.94) v1(52.41,97.62) v1(53.68,97.62) v1(54.91,97.62) v1(56.22,97.62) v1(57.49,80.23) v1(57.62,78.32) v1(57.62,76.8) v1(58.05,82.7) v1(58.51,81.11) v1(58.51,76.03) v1(67.5,61.53) v1(67.5,60.37) v1(68.91,55.72)
VCC: length 92.7
  Top Layer w0.254: v1(65.62,72.22) U15.16
  Top Layer w0.4: U16.16 63.84,61.43 65.11,62.7 65.11,64.66 ; SW1.1 35.36,96.2 32.73,93.56 32.73,92.12 ; 32.73,92.12 35.82,92.12 36.79,91.15 36.79,85.81 39.34,83.27 R18.2 ; 32.73,92.12 U2.8 31.85,84.67 C12.2 ; U16.10 71.46,64.61 U15.10 65.16,64.61 65.11,64.66 ; 65.11,64.66 65.11,70.07 v1(64.35,70.83) ; NOREF#8.4 67.78,72.5 U15.16
  Top Layer w0.5: 34.76,95.59 46.06,95.59 46.31,95.34 50.51,95.34 51.02,95.85 51.02,98.26 51.78,99.02 58.11,99.02 U4.3 ; C9.2 61.94,98.33 NOREF#83.4
  Top Layer w1: U4.3 59.78,98.51 C9.2
  Bottom Layer w0.254: v1(65.62,72.22) 65.62,72.1 v1(64.35,70.83)
(no net): length 157.8
  Top Layer w0.254: NOREF#7.2 44.85,89.68 U1.6 ; NOREF#62.1 54.57,92.55 53.66,91.63 52.62,91.63 ; 52.62,92.28 53.54,92.28 54.83,93.56 56.22,93.56 NOREF#42.1
  Top Layer w1: NOREF#56.3 NOREF#19.2 NOREF#59.3
  Bottom Layer w1: 11.27,43.24 NOREF#33.4 NOREF#15.3
BT+: length 38.8
  Top Layer w0.5: H1.1 18.34,85.04 U6.5 18.53,83.59 C7.2 ; H1.1 18.34,87.25 15.46,90.13 15.46,91.53 16.98,93.05 R16.2 ; H1.1 20.05,86.47 21.3,87.72 25.11,87.72 27.27,89.88 30.82,89.88 31.59,90.64 31.59,97.15 SW1.3 SW1.2
BT-: length 20.8
  Top Layer w0.5: 25.92,97.69 26.19,97.69 26.63,97.24 26.63,90.89 25.17,89.43 23.01,89.43 ; 25.92,97.69 26.12,97.89 H2.1 ; 25.92,97.69 U8.2 ; C8.2 17.8,89.69 18.5,88.99 22.57,88.99 23.01,89.43 ; 23.01,89.43 U7.6
PA0_ADC: length 27
  Top Layer w0.254: 52.62,87.08 52.62,87.08 54.7,87.08 54.05,87.73 52.62,87.73
  Top Layer w0.5: 61.12,84.04 61.14,84.06 ; 61.12,84.04 57.75,84.04 54.7,87.08 ; 61.12,84.04 62.7,84.04 v1(63.21,84.54) ; C36.2 70.51,89.04 R55.2 70.57,88.87 U14.7 70.57,85.94 69.81,85.18 v1(65.62,85.18)
  Bottom Layer w0.254: v1(63.21,84.54) v1(65.62,85.18)
PA4_NSS: length 20.8
  Top Layer w0.254: NOREF#23.1 53.68,89.62 52.62,89.68 ; v1(69.3,67.14) U15.12
  Top Layer w0.4: U16.12 68.92,61.43 69.3,61.81 v1(69.3,63.59) ; v1(69.3,67.14) 72.61,70.45 NOREF#54.2
  Bottom Layer w0.4: v1(69.3,63.59) v1(69.3,67.14)
PA5_SCK: length 33.1
  Top Layer w0.254: U1.7 48.31,89.03 48.73,88.61 48.73,85.56 NOREF#45.1
  Top Layer w0.4: NOREF#71.3 73.75,72.22 73.75,65.95 ; 73.75,65.95 73.75,57.62 72.99,56.86 70.83,56.86 70.19,57.49 U16.11 ; 73.75,65.95 73.68,65.88 U15.11
PA7_MOSI: length 8.8
  Top Layer w0.254: 52.62,90.33 53.81,90.26 NOREF#65.1
  Top Layer w0.4: U15.14 68.77,69.69 70.32,71.23 70.32,73.37 NOREF#43.1
PB0_FANG_DA: length 18.5
  Top Layer w0.254: U5.6 64.08,85.45 61.05,88.48 61.05,90.77 60.54,91.28 NOREF#5.1 54.4,90.98 52.62,90.98
PB3_TIM1_CH2_PWM: length 15.2
  Top Layer w0.254: U1.4 48.14,90.98 48.35,90.77 49.24,89.24 50.63,86.32 51.27,85.18 52.16,84.92 53.56,84.92 54.44,83.91 54.72,83.27 55.21,82.78 NOREF#18.TP1 55.01,81.94 55.01,80.6
$1N3675: length 65.5
  Top Layer w0.5: LED1.10 10.25,67.91 v1(20.63,67.91) v1(34,67.91) v1(47.45,67.91) 54.95,67.91 v1(55.21,67.65) ; U15.6 60.92,65.75 v1(59.14,65.24)
  Bottom Layer w0.5: v1(34,67.91) 34,67.91 LED3.10 ; v1(20.63,67.91) 20.66,67.94 LED2.10 ; v1(47.45,67.91) 47.46,67.92 LED4.10 ; v1(59.14,65.24) v1(55.21,67.65)
$1N3680: length 59.4
  Top Layer w0.5: 23.2,70.83 23.2,69.24 23.01,69.05 ; LED3.9 36.54,69.2 36.69,69.05 ; v1(56.73,69.05) 50.26,69.05 ; 50.26,69.05 36.69,69.05 ; 50.26,69.05 50,69.31 LED4.9 ; 36.69,69.05 23.01,69.05 ; U15.5 60.79,67.14 v1(60.29,66.64) ; 23.01,69.05 11.65,69.05 LED1.9
  Bottom Layer w0.5: v1(60.29,66.64) v1(56.73,69.05)
$1N5737: length 56
  Top Layer w0.254: U16.1 61.66,50.76 14.31,50.76 v1(12.41,52.67)
  Bottom Layer w0.4: v1(12.41,52.67) LED1.3
$1N5765: length 45.5
  Top Layer w0.254: U16.2 65.11,53.94 64.48,54.57 63.21,54.57 60.03,51.4 26.89,51.4 v1(25.74,52.54)
  Bottom Layer w0.254: v1(25.74,52.54) LED2.3
$1N5793: length 34.1
  Top Layer w0.254: U16.3 66.38,54.7 65.49,55.59 62.83,55.59 59.27,52.03 39.71,52.03 v1(39.08,52.67)
  Bottom Layer w0.4: v1(39.08,52.67) LED3.3
$1N5821: length 21.6
  Top Layer w0.254: 67.65,52.95 67.65,54.32 65.75,56.22 61.94,56.22 58.38,52.67 v1(52.67,52.67)
  Bottom Layer w0.4: v1(52.67,52.67) 52.67,55.46 LED4.3
$1N6685: length 2.3
  Top Layer w0.254: R4.2 80.74,52.91 LED6.1
$1N6896: length 2.4
  Top Layer w0.254: LED7.1 80.36,57.87 R5.2
$1N6922: length 2.3
  Top Layer w0.254: LED8.1 80.6,62.44 R6.2
$1N7000: length 11.6
  Top Layer w0.3: U16.5 68.92,51.68 69.84,50.76 77.93,50.76 R4.1
$1N7028: length 11.6
  Top Layer w0.3: U16.6 70.19,51.91 70.7,51.4 73.62,51.4 78.32,56.1 R5.1
$1N7057: length 11.2
  Top Layer w0.4: R6.1 78.32,60.8 72.99,55.46 72.35,55.46 71.46,54.57 U16.7
$1N8069: length 5.3
  Top Layer w0.4: U15.9 66.38,62.22 U16.14
$1N8265: length 2.3
  Top Layer w0.4: LED5.1 R3.2
$1N8293: length 67.4
  Top Layer w0.254: U16.15 65.11,57.37 64.6,56.86 61.05,56.86 57.49,53.3 6.82,53.3 3.01,57.11 R3.1
$1N8810: length 75.1
  Top Layer w0.5: v1(54.19,60.29) 53.43,59.53 v1(47.46,59.53) v1(34.02,59.53) v1(20.66,59.53) 10.38,59.53 7.58,56.73 7.58,55.84 LED1.1 ; U15.4 60.68,68.42 57.38,65.12 v1(57.38,60.29)
  Bottom Layer w0.5: LED4.1 47.46,59.52 v1(47.46,59.53) ; v1(57.38,60.29) v1(54.19,60.29) ; LED2.1 20.66,59.52 v1(20.66,59.53) ; v1(34.02,59.53) 34,59.51 LED3.1
$1N8839: length 70.1
  Top Layer w0.5: U15.3 60.52,69.69 56.22,65.39 v1(56.22,58.25) ; LED1.2 12.53,58.25 v1(23.2,58.25) v1(36.48,58.25) v1(54.19,58.25)
  Bottom Layer w0.5: v1(36.48,58.25) 36.54,58.2 LED3.2 ; v1(50.01,58.21) 50,58.19 LED4.2 ; 23.2,55.59 v1(23.2,58.25) ; v1(56.22,58.25) v1(54.19,58.25)
$1N8868: length 63.4
  Top Layer w0.5: 41.53,57.14 54.83,57.14 55.08,56.89 ; 41.53,57.14 28.3,57.14 ; 41.53,57.14 41.62,57.05 LED3.4 ; 55.08,56.89 55.08,66 60.03,70.95 U15.2 ; 55.08,56.89 LED4.4 ; LED2.4 28.28,57.12 28.3,57.14 ; 28.3,57.14 16.5,57.14 LED1.4
$1N8897: length 56.5
  Top Layer w0.5: U15.7 60.79,64.61 59.14,62.95 59.14,57.11 LED4.5 56.22,54.19 44.28,54.19 44.16,54.32 ; 30.82,54.19 30.82,54.09 30.72,54.19 18.11,54.19 17.49,54.82 LED1.5 ; 30.82,54.19 LED2.5 ; 30.82,54.19 41.71,54.19 ; 44.16,54.32 44.16,54.19 44.03,54.19 ; 44.16,54.32 LED3.5 ; 44.16,54.32 44.03,54.19 ; 41.67,54.15 41.71,54.19 ; 41.71,54.19 44.03,54.19
$1N9196: length 49.5
  Top Layer w0.5: LED1.6 17.49,71.08 18.63,72.22 30.75,72.22 ; 30.75,72.22 30.82,72.15 LED2.6 ; 30.75,72.22 44.07,72.22 ; LED3.6 44.16,72.14 44.07,72.22 ; LED4.6 57.62,72.14 57.7,72.22 ; 57.7,72.22 44.07,72.22 ; 57.7,72.22 U15.1
$1N9408: length 63.5
  Top Layer w0.5: U15.15 65.62,70.95 63.08,73.5 v1(55.19,73.5) v1(41.64,73.5) v1(28.32,73.5) 16.34,73.5 15.08,72.22 15.08,70.95 LED1.7
  Bottom Layer w0.5: LED2.7 28.28,73.46 v1(28.32,73.5) ; v1(55.19,73.5) 55.08,73.39 LED4.7 ; LED3.7 41.62,73.47 v1(41.64,73.5)
$1N11543: length 6.3
  Top Layer w0.254: U1.8 45.05,88.48 X1.1
  Top Layer w0.5: X1.1 C1.1
$1N11575: length 10.2
  Top Layer w0.254: 40.52,87.38 41.11,86.32 42.13,85.81 42.76,85.81 43.52,86.07 44.16,86.45 44.54,87.08 45.3,87.72 U1.9
  Top Layer w0.5: 40.52,87.38 C2.2
$1N11831: length 1.5
  Top Layer w0.254: U1.10 46.76,85.56
$1N12390: length 9.6
  Top Layer w0.254: U1.5 45.23,90.33 43.4,92.16 40.6,92.16 39.32,90.89 R7.2
$1N13187: length 4
  Top Layer w0.254: H8.1 44.41,93.18 44.41,93.05 45.19,92.28 U1.2
$1N13230: length 6.6
  Top Layer w0.254: H9.1 41.77,92.67 43.78,92.67 44.82,91.63 U1.3
$1N13991: length 4.2
  Top Layer w0.5: U9.3 U8.3
$1N14154: length 4.1
  Top Layer w0.254: U8.1 24.54,95.79 23.01,94.26 23.01,92.88
$1N14198: length 3
  Top Layer w0.254: 21.11,92.88 21.11,95.58 U9.1
$1N14351: length 3.9
  Top Layer w0.254: R8.2 24.72,91.78 22.44,91.78 22.06,92.16 22.06,92.88
$1N14884: length 3.4
  Top Layer w0.5: R11.2 R10.2 9.27,78.22 R9.1
$1N15015: length 5.6
  Top Layer w0.5: U6.2 14.35,77.22 13.81,76.67 11.9,76.67 10.75,77.82 R9.2
$1N15682: length 3.9
  Top Layer w0.5: 10,97.37 11.01,96.35 R12.2
$1N15797: length 4.3
  Top Layer w0.5: R13.2 15.71,96.09 LED10.2
$1N15845: length 10.2
  Top Layer w0.5: R12.1 11.01,91.02 14.35,87.68 U6.7
$1N15894: length 9.7
  Top Layer w0.5: U6.6 15.62,88.06 13.55,90.13 R13.1
$1N16826: length 2.2
  Top Layer w0.254: USB1.4 8.25,88.59 R14.2
$1N16875: length 2.5
  Top Layer w0.254: USB1.10 7.49,85.59 R15.2
$1N17421: length 54.7
  Top Layer w0.5: 8.56,89.75 9.61,89.75 arc(11.23,89.08) 11.9,87.47 arc(11.54,86.16) 10.56,85.23 ; 8.56,89.75 6.54,89.75 arc(6.53,89.75) USB1.2 ; 8.56,89.75 8.6,89.79 8.6,94.07 7.45,95.21 LED9.1 7.45,97.75 8.85,99.15 11.39,99.15 LED10.1 ; USB1.11 8.68,84.94 ; 8.68,84.94 9.37,84.94 arc(9.98,85.01) 10.56,85.23 ; 8.68,84.94 8.72,84.89 8.72,83.27 7.45,82 7.45,76.92 8.72,75.65 15.71,75.65 16.89,76.83 U6.4 18.91,78.11 C6.1 ; 10.56,85.23 11.44,85.23 U6.8
$1N19532: length 6.2
  Top Layer w0.254: 19.31,90.87 C8.1
  Top Layer w0.5: 19.26,91.41 21.68,91.41 22.06,91.03 U7.5 ; 19.26,91.41 R16.1 ; 19.26,91.41 19.26,90.93 19.31,90.87
$1N29722: length 5.6
  Top Layer w0.4: C21.2 28.78,80.12 R27.1
  Top Layer w0.8: C21.2 C19.2 C13.2
$1N30545: length 9.1
  Top Layer w0.4: R29.2 U2.6 35.27,82.13 34.26,81.12 R28.2
$1N31466: length 11.8
  Top Layer w0.4: R17.1 30.7,78.32 31.07,78.68 R27.2 31.83,80.1 34.76,80.1 36.54,81.88 U2.5
$1N35483: length 12
  Top Layer w0.4: NOREF#16.3 28.36,82.63 R28.1 31.09,82.63 31.59,82.13 33.49,82.13 34,82.64 U2.7
  Top Layer w1: D1.1 28.93,87.73 NOREF#31.2
$1N36571: length 5.2
  Top Layer w0.4: 32.73,76.68 U2.1 ; 32.73,76.68 33.5,76.68 34,77.18 U2.2 ; 32.73,76.68 R17.2
$1N41452: length 4.8
  Top Layer w0.4: 46.85,80.6 46.64,80.38 C40.1 ; 46.85,80.6 R33.2 ; 46.85,80.6 46.64,80.6 ; 46.64,80.6 45.87,80.6 ; 46.64,80.6 46.64,80.6 46.64,82.19
$1N41532: length 5.1
  Top Layer w0.4: C16.2 44.03,80.67 43.96,80.61 ; 43.96,80.61 C15.2 ; 43.96,80.61 44.35,80.61 R34.2 43.85,80.08 C39.1
$1N41612: length 8.9
  Top Layer w0.4: R18.1 39.46,80.58 ; 39.46,80.58 39.48,80.61 C15.1 ; 39.46,80.58 R30.2 36.28,80.22 35.27,79.21 U2.3
$1N44249: length 6
  Top Layer w0.4: 25.93,77.88 NOREF#41.5 ; 25.93,77.88 27.08,77.88 28.41,76.54 ; 25.93,77.88 27.39,76.42
$1N45108: length 1.6
  Top Layer w0.4: R29.1 C14.2
$1N80691: length 9.5
  Top Layer w0.4: R39.2 82.77,82.52 82.38,82.13 82.38,80.59
  Top Layer w0.5: C25.1 82.25,77.1 R37.1 82.38,78.84 82.38,80.59
$1N81427: length 8
  Top Layer w0.4: U13.6 83.66,84.67 84.29,84.04 86.57,84.04 R39.1
  Top Layer w0.5: 83.85,89.37 83.9,89.32 R38.1 83.66,87.47 U13.6
$1N81532: length 10.9
  Top Layer w0.254: R43.1 77.56,84.67 77.94,84.29 81.88,84.29 82.38,84.8 82.38,85.96
  Top Layer w0.5: C26.2 82.45,87.77 R38.2 82.38,87.71 82.38,85.96
$1N83998: length 1.9
  Top Layer w0.5: C28.1 71.45,77.56 R44.2
$1N85039: length 8
  Top Layer w0.254: U14.2 70.57,82.13 72.22,83.78 73.62,83.78 74.51,84.67 R43.2
  Top Layer w0.5: R42.1 70.57,79.85 U14.2
$1N86076: length 6.2
  Top Layer w0.254: U14.3 71.84,82.39 72.61,83.15 R45.2
  Top Layer w0.5: U14.3 71.84,79.71 R44.1
$1N86077: length 9.8
  Top Layer w0.254: R45.1 79.08,83.15 81.12,81.11 U13.1
  Top Layer w0.5: U13.1 80.74,80.22 R37.2 80.74,77.1 C25.2
$1N94982: length 15.2
  Top Layer w0.254: R47.2 94.58,78.08 94.58,77.56 94.07,77.05 Q4.3
  Top Layer w0.5: Q4.3 89.42,77.05 Q3.1 88.53,76.29 85.81,76.29 83.66,78.45 U13.3
$1N95485: length 18.6
  Top Layer w0.254: Q2.3 93.3,97.12 R46.2
  Top Layer w0.5: Q2.3 90.47,97.06 Q1.1 85.56,93.64 85.56,86.59 U13.5
$1N97809: length 1.8
  Top Layer w0.5: R20.2 R19.1
$1N97810: length 1.5
  Top Layer w0.5: R21.2 R20.1
$1N99087: length 4.7
  Top Layer w0.254: U5.3 65.64,80.4 65.64,80.08 v1(65.75,79.97)
  Top Layer w0.5: R19.2 63.46,77.81 64.72,77.81 v1(65.11,78.19)
  Bottom Layer w0.254: v1(65.75,79.97) v1(65.11,78.19)
$1N104717: length 9.9
  Top Layer w0.254: R53.2 66.37,78.83 66.12,79.08 64.58,79.08 64.08,79.58 U5.1
  Top Layer w0.5: U14.1 68.8,81.11 R42.2 68.03,79.59 R53.2
$1N108179: length 2.5
  Top Layer w0.5: R23.2 R22.1
$1N108180: length 1.5
  Top Layer w0.5: R54.2 R23.1
$1N108784: length 1.9
  Top Layer w0.5: C35.2 75.02,95.71 R54.1
$1N111292: length 1.4
  Top Layer w0.254: U5.4 C37.2
$1N135539: length 4.7
  Top Layer w0.4: 52.74,82.19 52.74,80.6 52.73,80.6 51.97,80.6 ; C42.1 52.74,80.6 R32.2
$1N135540: length 4.8
  Top Layer w0.4: R31.2 49.63,80.6 ; 49.63,80.6 49.56,80.67 49.56,82.19 ; 49.63,80.6 49.69,80.54 C41.1 ; 49.63,80.6 48.92,80.6
$1N150179: length 19.3
  Top Layer w0.5: 67.59,83.53 70.7,84.04 73.02,85.78 U14.5 73.11,87.59 78.57,93.05 ; 78.57,93.05 78.82,92.81 R56.2 ; 78.57,93.05 R57.1
$1N150210: length 6.5
  Top Layer w0.5: U14.6 71.84,88.98 71.91,89.04 ; 71.91,89.04 R55.1 ; 71.91,89.04 C36.1 71.84,90.71 R22.2
$1N150464: length 3.2
  Top Layer w0.5: H4.1 98.02,82.18 C43.1
$1N150468: length 4.7
  Top Layer w0.5: R48.2 C43.2 94.89,79.89 R47.1
$1N150580: length 4.8
  Top Layer w0.5: R49.1 94.45,92.11 C44.2 94.32,92.86 R46.1
$1N150583: length 3.1
  Top Layer w0.5: C44.1 98.02,92.34 H6.1
$1N158319: length 11.5
  Top Layer w0.254: SW5.2 v1(46.85,97.09) v1(47.84,96.1) ; v1(47.84,94.45) 50.63,88.73 51.65,88.38 52.62,88.38
  Bottom Layer w0.254: v1(47.84,96.1) v1(47.84,94.45)
$1N158326: length 18.5
  Top Layer w0.254: 52.62,89.03 51.65,89.03 51.14,89.37 v1(48.86,94.45) ; v1(48.86,96.1) 48.86,96.74 46.82,98.77 44.03,98.77 42.4,97.13 SW4.2
  Bottom Layer w0.254: v1(48.86,96.1) v1(48.86,94.45)

## Copper pours and planes (outline as drawn; the poured copper is in the pictures)
+3.3V on Top Layer: 51.96,95.01 56.73,95.01 56.73,94.32 51.96,94.32
+3.3V on Top Layer: 52.39,94.35 53.25,94.35 53.25,92.8 52.39,92.8
GND on Top Layer: 36.28,79.08 38.32,79.08 38.32,75.27 36.28,75.27
GND on Top Layer: 51.91,97.88 56.94,97.88 56.94,95.76 51.91,95.76
GND on Top Layer: 46.08,93.9 47.59,93.9 47.59,92.8 46.08,92.8
GND on Top Layer: 56.99,83.15 59.12,83.15 59.12,75 56.99,75
GND on Top Layer: 28.03,98.51 29.81,98.51 29.81,92.03 28.03,92.03
GND on Top Layer: 0,74.98 100.01,74.98 100.01,0.07 0,0.07
GND on Bottom Layer: 0,100 100.01,100 100.01,0.07 0,0.07
(no net) on Top Layer: 42.62,26.51 49.86,26.51 49.86,20.36 42.62,20.36
(no net) on Top Layer: 92.66,6.44 99.9,6.44 99.9,0.3 92.66,0.3
(no net) on Top Layer: 50.14,19.95 57.38,19.95 57.38,13.8 50.14,13.8
(no net) on Top Layer: 92.66,26.51 99.9,26.51 99.9,20.36 92.66,20.36
(no net) on Top Layer: 0.1,19.95 7.34,19.95 7.34,13.8 0.1,13.8
(no net) on Top Layer: 42.62,6.44 49.86,6.44 49.86,0.3 42.62,0.3
(no net) on Top Layer: 50.14,40.01 57.38,40.01 57.38,33.87 50.14,33.87
(no net) on Top Layer: 0.1,40.01 7.34,40.01 7.34,33.87 0.1,33.87
(no net) on Bottom Layer: 50.14,40.01 57.38,40.01 57.38,33.87 50.14,33.87
(no net) on Bottom Layer: 92.66,26.51 99.89,26.51 99.89,20.36 92.66,20.36
(no net) on Bottom Layer: 42.62,26.51 49.86,26.51 49.86,20.36 42.62,20.36
(no net) on Bottom Layer: 50.14,19.95 57.38,19.95 57.38,13.8 50.14,13.8
(no net) on Bottom Layer: 42.62,6.44 49.86,6.44 49.86,0.3 42.62,0.3
(no net) on Bottom Layer: 92.66,6.44 99.89,6.44 99.89,0.3 92.66,0.3
(no net) on Bottom Layer: 0.11,40.01 7.34,40.01 7.34,33.87 0.11,33.87
(no net) on Bottom Layer: 0.11,19.95 7.34,19.95 7.34,13.8 0.11,13.8

## Text on the board
Bottom Silkscreen Layer: GND | VCC | SPI_MOSI | SPI_NSS | SPI_SCK | - | + | 按键1 | 按键2 | 充电中 | 充满 | 电池负极 | 功放激励信号输出 | 夹 / 子 / 信 / 号 / 线 | 电池正极 | 飞线 | 电池负
Top Silkscreen Layer: 2023-07-20 | yjmwxwx | 负 | 莱 / 州 | 毫欧 | 校准 | 欧
